# EAGLE schematic auxDaqUnitBottom2022 (EAGLE 9.6.2)

## Sheet 1 of 3
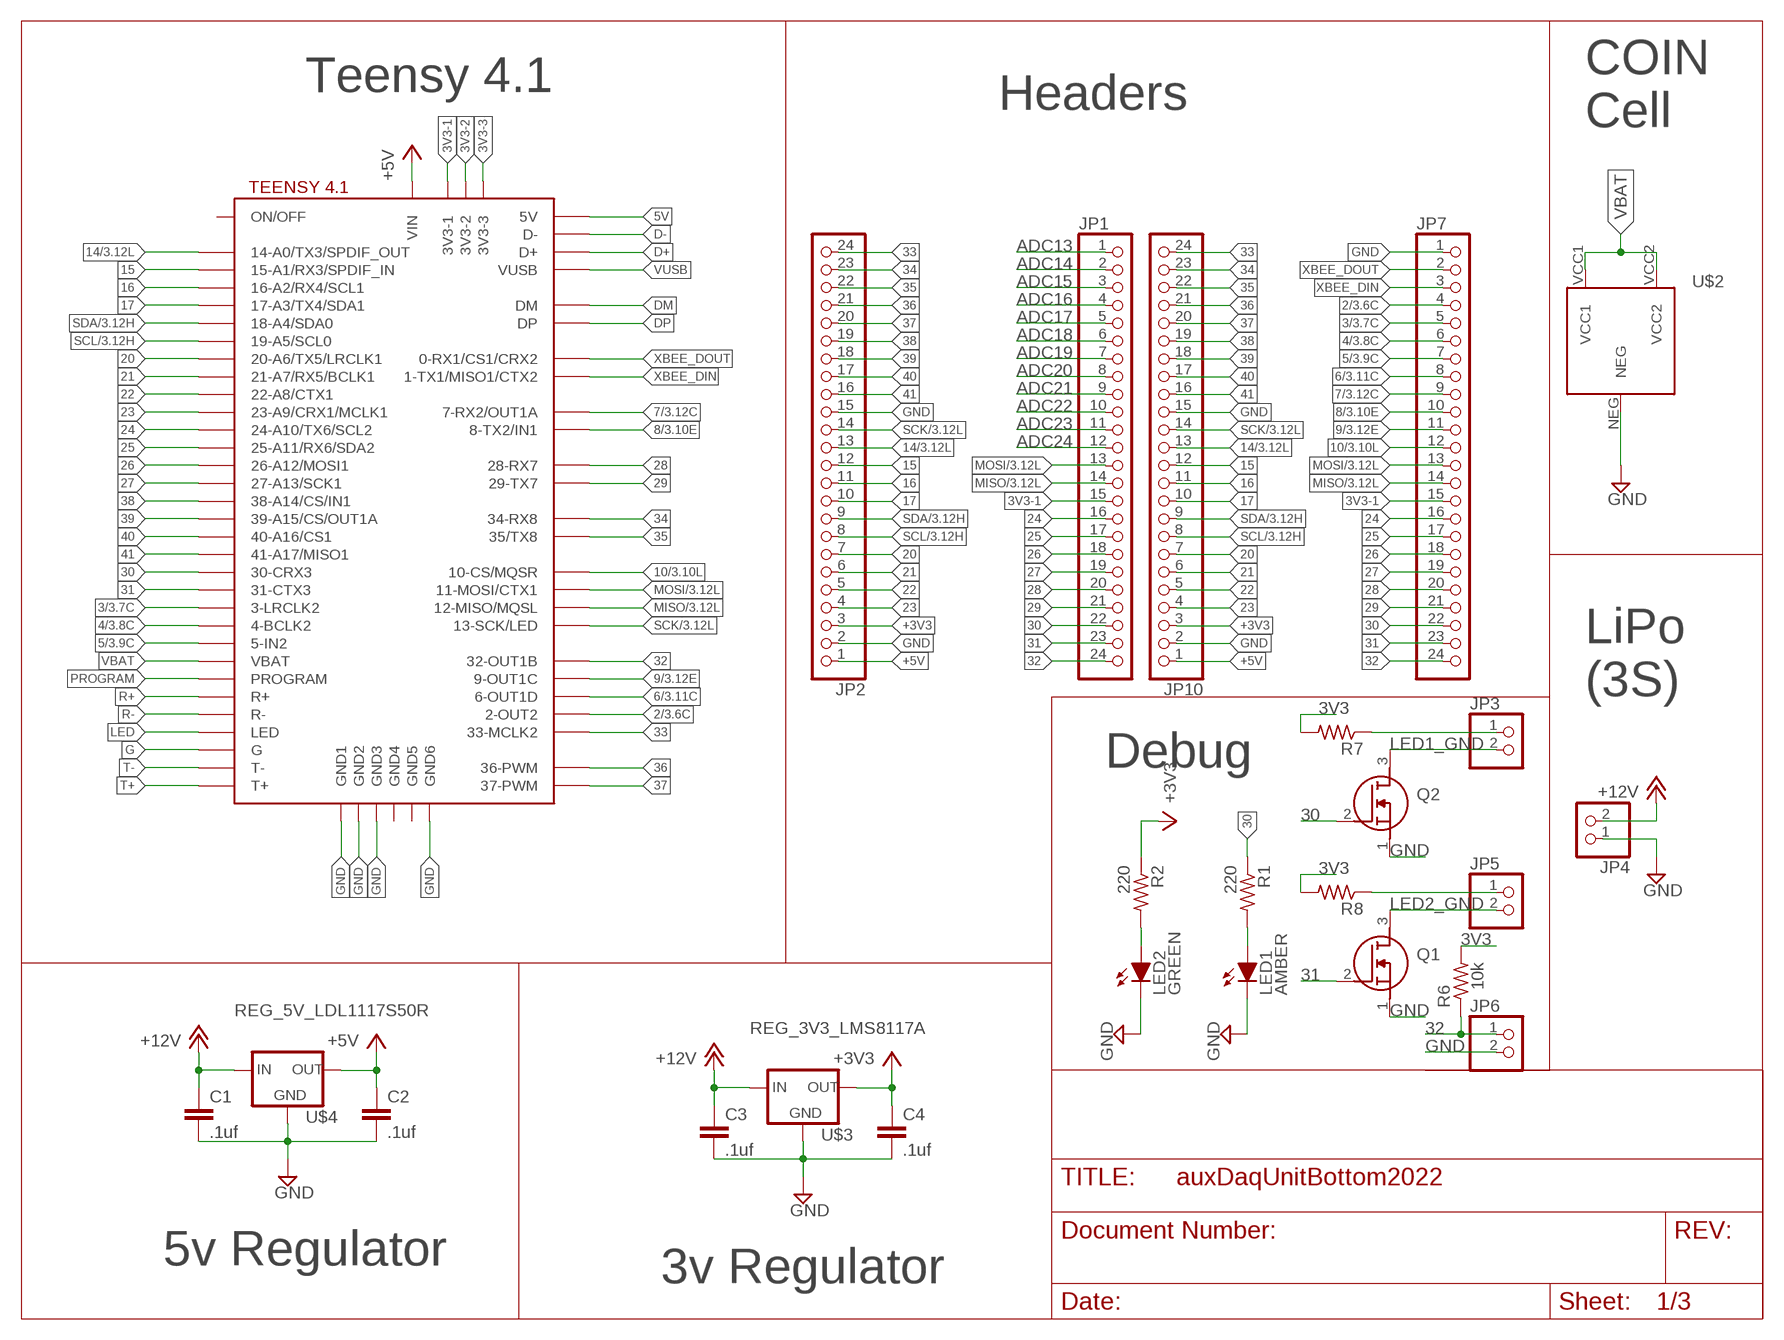
[diagram p0: schematic, sheet 1]
FRAME1 (LETTER_L): NAMEYEAR: PETER2022

### Parts
C1  .1uf  CAP_SMDC0603  [C0603]
C2  .1uf  CAP_SMDC0603  [C0603]
C3  .1uf  CAP_SMDC0603  [C0603]
C4  .1uf  CAP_SMDC0603  [C0603]
JP1  PINHD-1X24  [1X24]
JP2  PINHD-1X24  [1X24]
JP3  PINHD-1X2  [1X02]
JP4  PINHD-1X2  [1X02]
JP5  PINHD-1X2  [1X02]
JP6  PINHD-1X2  [1X02]
JP7  PINHD-1X24  [1X24]
JP10  PINHD-1X24  [1X24]
LED1  AMBER  LED-0603  [LED-603]
LED2  GREEN  LED-0603  [LED-603]
Q1  MOSFET_N-TYPE_RK7002BMT116  [BSS64AHZGT116]
Q2  MOSFET_N-TYPE_RK7002BMT116  [BSS64AHZGT116]
R1  220  RES_SMDR0603  [R0603]
R2  220  RES_SMDR0603  [R0603]
R6  10k  RES_SMDR0603  [R0603]
R7  RES_SMDR0603  [R0603]
R8  RES_SMDR0603  [R0603]
U$1  TEENSY41  [TEENSY41]
U$2  KEYSTONE3035  [KEYSTONE3035]
U$3  REG_3V3_LMS8117A  [SOT223]
U$4  REG_5V_LDL1117S50R  [SOT230P700X180-4N]

### Nets
2: JP7.4 U$1.2-OUT2 ; also sheet 3
3: JP7.5 U$1.3-LRCLK2 ; also sheet 3
3V3: R6.2 R7.2 R8.2
3V3-1: JP1.15 JP7.15 U$1.3V3-1
3V3-2: U$1.3V3-2
3V3-3: U$1.3V3-3
4: JP7.6 U$1.4-BCLK2 ; also sheet 3
5: JP7.7 U$1.5-IN2 ; also sheet 3
5V: U$1.+5V(5V)
6: JP7.8 U$1.6-OUT1D ; also sheet 3
7: JP7.9 U$1.7-RX2/OUT1A ; also sheet 3
8: JP7.10 U$1.8-TX2/IN2(8-TX2/IN1) ; also sheet 3
9: JP7.11 U$1.9-OUT1C ; also sheet 3
10: JP7.12 U$1.10-CS\MQSR(10-CS/MQSR) ; also sheet 3
14: JP2.13 JP10.13 U$1.14-A0/TX3/SPDIF_OUT ; also sheet 3
15: JP2.12 JP10.12 U$1.15-A1/RX3/SPDIF_IN
16: JP2.11 JP10.11 U$1.16-A2/RX4/SCL1
17: JP2.10 JP10.10 U$1.17-A3/TX4/SDA1
20: JP2.7 JP10.7 U$1.20-A6/TX5/LRCLK1
21: JP2.6 JP10.6 U$1.21-A7/RX5/BCLK1
22: JP2.5 JP10.5 U$1.22-A8/CTX1
23: JP2.4 JP10.4 U$1.23-A9/CRX1/MCLK1
24: JP1.16 JP7.16 U$1.24-A10/TX6/SCL2
25: JP1.17 JP7.17 U$1.25-A11/RX6/SDA2
26: JP1.18 JP7.18 U$1.26-A12/MOSI1
27: JP1.19 JP7.19 U$1.27-A13/SCK1
28: JP1.20 JP7.20 U$1.28-RX7
29: JP1.21 JP7.21 U$1.29-TX7
30: JP1.22 JP7.22 Q2.2(G) R1.1 U$1.30-CRX3
31: JP1.23 JP7.23 Q1.2(G) U$1.31-CTX3
32: JP1.24 JP6.1 JP7.24 R6.1 U$1.32-OUT1B
33: JP2.24 JP10.24 U$1.33-MCLK2 ; also sheet 2
34: JP2.23 JP10.23 U$1.34-RX8 ; also sheet 2
35: JP2.22 JP10.22 U$1.35-TX8(35/TX8) ; also sheet 2
36: JP2.21 JP10.21 U$1.36-PWM
37: JP2.20 JP10.20 U$1.37-PWM
38: JP2.19 JP10.19 U$1.38-A14/CS/IN1
39: JP2.18 JP10.18 U$1.39-A15/CS/OUT1A
40: JP2.17 JP10.17 U$1.40-A16/CS1
41: JP2.16 JP10.16 U$1.41-A17/MISO1
+3V3: C4.1 JP2.3 JP10.3 R2.1 U$3.2(OUT) U$3.4(OUT) ; also sheet 2,3
+5V: C2.1 JP2.1 JP10.1 U$1.VIN U$4.2(OUT) U$4.4(OUT) ; also sheet 2,3
+12V: C1.1 C3.1 JP4.2 U$3.3(IN) U$4.3(IN)
ADC13: JP1.1 ; also sheet 2
ADC14: JP1.2 ; also sheet 2
ADC15: JP1.3 ; also sheet 2
ADC16: JP1.4 ; also sheet 2
ADC17: JP1.5 ; also sheet 2
ADC18: JP1.6 ; also sheet 2
ADC19: JP1.7 ; also sheet 2
ADC20: JP1.8 ; also sheet 2
ADC21: JP1.9 ; also sheet 2
ADC22: JP1.10 ; also sheet 2
ADC23: JP1.11 ; also sheet 2
ADC24: JP1.12 ; also sheet 2
D+: U$1.D+
D-: U$1.D-
DM: U$1.DM
DP: U$1.DP
G: U$1.G
GND: C1.2 C2.2 C3.2 C4.2 JP2.2 JP2.15 JP4.1 JP6.2 JP7.1 JP10.2 JP10.15 LED1.C LED2.C Q1.1(S) Q2.1(S) U$1.GND1 U$1.GND2 U$1.GND3 U$1.GND6 U$2.NEG U$3.1(GND) U$4.1(GND) ; also sheet 2,3
LED: U$1.LED
LED1_GND: JP3.2 Q2.3(D)
LED2_GND: JP5.2 Q1.3(D)
MISO: JP1.14 JP7.14 U$1.12-MISO/MQSL ; also sheet 2,3
MOSI: JP1.13 JP7.13 U$1.11-MOSI/CTX1 ; also sheet 2,3
N$1: LED1.A R1.2
N$2: LED2.A R2.2
N$3: JP3.1 R7.1
N$4: JP5.1 R8.1
PROGRAM: U$1.PROGRAM
R+: U$1.R+
R-: U$1.R-
SCK: JP2.14 JP10.14 U$1.13-SCK/LED ; also sheet 2,3
SCL: JP2.8 JP10.8 U$1.19-A5/SCL0 ; also sheet 3
SDA: JP2.9 JP10.9 U$1.18-A4/SDA0 ; also sheet 3
T+: U$1.T+
T-: U$1.T-
VBAT: U$1.VBAT U$2.VCC1 U$2.VCC2
VUSB: U$1.VUSB
XBEE_DIN: JP7.3 U$1.1-TX1/MISO1/CTX2 ; also sheet 2
XBEE_DOUT: JP7.2 U$1.0-RX1/CS1/CRX2 ; also sheet 2
Unconnected: U$1.GND4 U$1.GND5 U$1.ON/OFF

### Notes on the sheet
- Teensy 4.1
- Headers
- COIN
  Cell
- LiPo
  (3S)
- Debug
- 5v Regulator
- 3v Regulator

## Sheet 2 of 3
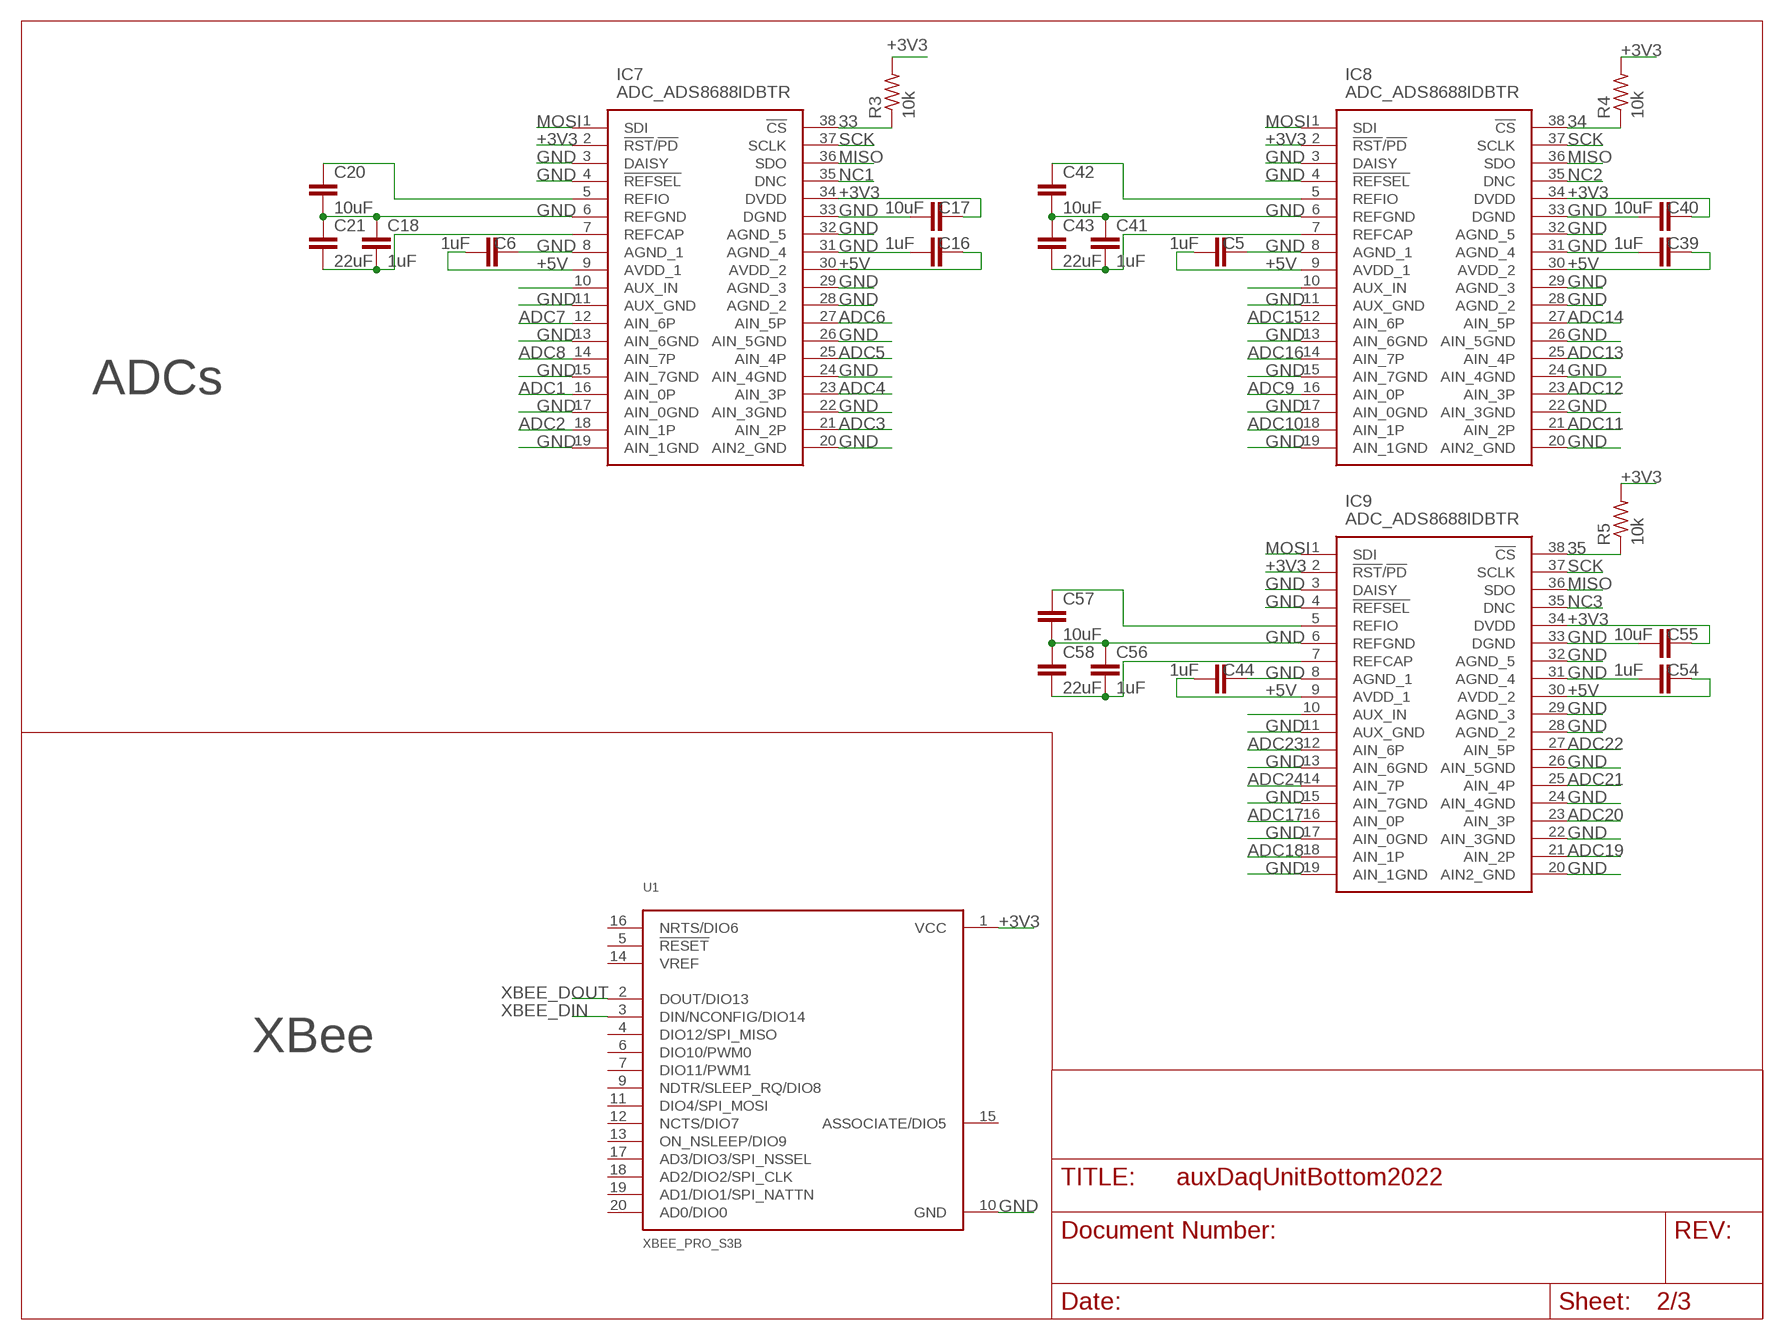
[diagram p1: schematic, sheet 2]

### Parts
C5  1uF  CAP_SMDC0603  [C0603]
C6  1uF  CAP_SMDC0603  [C0603]
C16  1uF  CAP_SMDC0603  [C0603]
C17  10uF  CAP_SMDC0603  [C0603]
C18  1uF  CAP_SMDC0603  [C0603]
C20  10uF  CAP_SMDC0805  [C0805]
C21  22uF  CAP_SMDC1210  [C1210]
C39  1uF  CAP_SMDC0603  [C0603]
C40  10uF  CAP_SMDC0603  [C0603]
C41  1uF  CAP_SMDC0603  [C0603]
C42  10uF  CAP_SMDC0805  [C0805]
C43  22uF  CAP_SMDC1210  [C1210]
C44  1uF  CAP_SMDC0603  [C0603]
C54  1uF  CAP_SMDC0603  [C0603]
C55  10uF  CAP_SMDC0603  [C0603]
C56  1uF  CAP_SMDC0603  [C0603]
C57  10uF  CAP_SMDC0805  [C0805]
C58  22uF  CAP_SMDC1210  [C1210]
IC7  ADC_ADS8688IDBTR  [SOP50P640X120-38N]
IC8  ADC_ADS8688IDBTR  [SOP50P640X120-38N]
IC9  ADC_ADS8688IDBTR  [SOP50P640X120-38N]
R3  10k  RES_SMDR0603  [R0603]
R4  10k  RES_SMDR0603  [R0603]
R5  10k  RES_SMDR0603  [R0603]
U1  XBEE_PRO_S3B  [XBEE_PRO_S3B]

### Nets
33: IC7.38(!CS) R3.1 ; also sheet 1
34: IC8.38(!CS) R4.1 ; also sheet 1
35: IC9.38(!CS) R5.1 ; also sheet 1
+3V3: C17.1 C40.1 C55.1 IC7.2(!RST!/!PD) IC7.34(DVDD) IC8.2(!RST!/!PD) IC8.34(DVDD) IC9.2(!RST!/!PD) IC9.34(DVDD) R3.2 R4.2 R5.2 U1.1(VCC) ; also sheet 1,3
+5V: C5.2 C6.2 C16.1 C39.1 C44.2 C54.1 IC7.9(AVDD_1) IC7.30(AVDD_2) IC8.9(AVDD_1) IC8.30(AVDD_2) IC9.9(AVDD_1) IC9.30(AVDD_2) ; also sheet 1,3
ADC1: IC7.16(AIN_0P) ; also sheet 3
ADC2: IC7.18(AIN_1P) ; also sheet 3
ADC3: IC7.21(AIN_2P) ; also sheet 3
ADC4: IC7.23(AIN_3P) ; also sheet 3
ADC5: IC7.25(AIN_4P) ; also sheet 3
ADC6: IC7.27(AIN_5P) ; also sheet 3
ADC7: IC7.12(AIN_6P) ; also sheet 3
ADC8: IC7.14(AIN_7P) ; also sheet 3
ADC9: IC8.16(AIN_0P) ; also sheet 3
ADC10: IC8.18(AIN_1P) ; also sheet 3
ADC11: IC8.21(AIN_2P) ; also sheet 3
ADC12: IC8.23(AIN_3P) ; also sheet 3
ADC13: IC8.25(AIN_4P) ; also sheet 1
ADC14: IC8.27(AIN_5P) ; also sheet 1
ADC15: IC8.12(AIN_6P) ; also sheet 1
ADC16: IC8.14(AIN_7P) ; also sheet 1
ADC17: IC9.16(AIN_0P) ; also sheet 1
ADC18: IC9.18(AIN_1P) ; also sheet 1
ADC19: IC9.21(AIN_2P) ; also sheet 1
ADC20: IC9.23(AIN_3P) ; also sheet 1
ADC21: IC9.25(AIN_4P) ; also sheet 1
ADC22: IC9.27(AIN_5P) ; also sheet 1
ADC23: IC9.12(AIN_6P) ; also sheet 1
ADC24: IC9.14(AIN_7P) ; also sheet 1
GND: C5.1 C6.1 C16.2 C17.2 C18.1 C20.2 C21.1 C39.2 C40.2 C41.1 C42.2 C43.1 C44.1 C54.2 C55.2 C56.1 C57.2 C58.1 IC7.3(DAISY) IC7.4(!REFSEL) IC7.6(REFGND) IC7.8(AGND_1) IC7.11(AUX_GND) IC7.13(AIN_6GND) IC7.15(AIN_7GND) IC7.17(AIN_0GND) IC7.19(AIN_1GND) IC7.20(AIN2_GND) IC7.22(AIN_3GND) IC7.24(AIN_4GND) IC7.26(AIN_5GND) IC7.28(AGND_2) IC7.29(AGND_3) IC7.31(AGND_4) IC7.32(AGND_5) IC7.33(DGND) IC8.3(DAISY) IC8.4(!REFSEL) IC8.6(REFGND) IC8.8(AGND_1) IC8.11(AUX_GND) IC8.13(AIN_6GND) IC8.15(AIN_7GND) IC8.17(AIN_0GND) IC8.19(AIN_1GND) IC8.20(AIN2_GND) IC8.22(AIN_3GND) IC8.24(AIN_4GND) IC8.26(AIN_5GND) IC8.28(AGND_2) IC8.29(AGND_3) IC8.31(AGND_4) IC8.32(AGND_5) IC8.33(DGND) IC9.3(DAISY) IC9.4(!REFSEL) IC9.6(REFGND) IC9.8(AGND_1) IC9.11(AUX_GND) IC9.13(AIN_6GND) IC9.15(AIN_7GND) IC9.17(AIN_0GND) IC9.19(AIN_1GND) IC9.20(AIN2_GND) IC9.22(AIN_3GND) IC9.24(AIN_4GND) IC9.26(AIN_5GND) IC9.28(AGND_2) IC9.29(AGND_3) IC9.31(AGND_4) IC9.32(AGND_5) IC9.33(DGND) U1.10(GND) ; also sheet 1,3
MISO: IC7.36(SDO) IC8.36(SDO) IC9.36(SDO) ; also sheet 1,3
MOSI: IC7.1(SDI) IC8.1(SDI) IC9.1(SDI) ; also sheet 1,3
N$6: C20.1 IC7.5(REFIO)
N$7: C41.2 C43.2 IC8.7(REFCAP)
N$8: IC8.10(AUX_IN)
N$13: C18.2 C21.2 IC7.7(REFCAP)
N$17: IC7.10(AUX_IN)
N$28: C42.1 IC8.5(REFIO)
N$31: C56.2 C58.2 IC9.7(REFCAP)
N$32: IC9.10(AUX_IN)
N$45: C57.1 IC9.5(REFIO)
NC1: IC7.35(DNC)
NC2: IC8.35(DNC)
NC3: IC9.35(DNC)
SCK: IC7.37(SCLK) IC8.37(SCLK) IC9.37(SCLK) ; also sheet 1,3
XBEE_DIN: U1.3(DIN/NCONFIG/DIO14) ; also sheet 1
XBEE_DOUT: U1.2(DOUT/DIO13) ; also sheet 1
Unconnected: U1.4(DIO12/SPI_MISO) U1.5(!RESET) U1.6(DIO10/PWM0) U1.7(DIO11/PWM1) U1.9(NDTR/SLEEP_RQ/DIO8) U1.11(DIO4/SPI_MOSI) U1.12(NCTS/DIO7) U1.13(ON_NSLEEP/DIO9) U1.14(VREF) U1.15(ASSOCIATE/DIO5) U1.16(NRTS/DIO6) U1.17(AD3/DIO3/SPI_NSSEL) U1.18(AD2/DIO2/SPI_CLK) U1.19(AD1/DIO1/SPI_NATTN) U1.20(AD0/DIO0)

### Notes on the sheet
- ADCs
- XBee

## Sheet 3 of 3
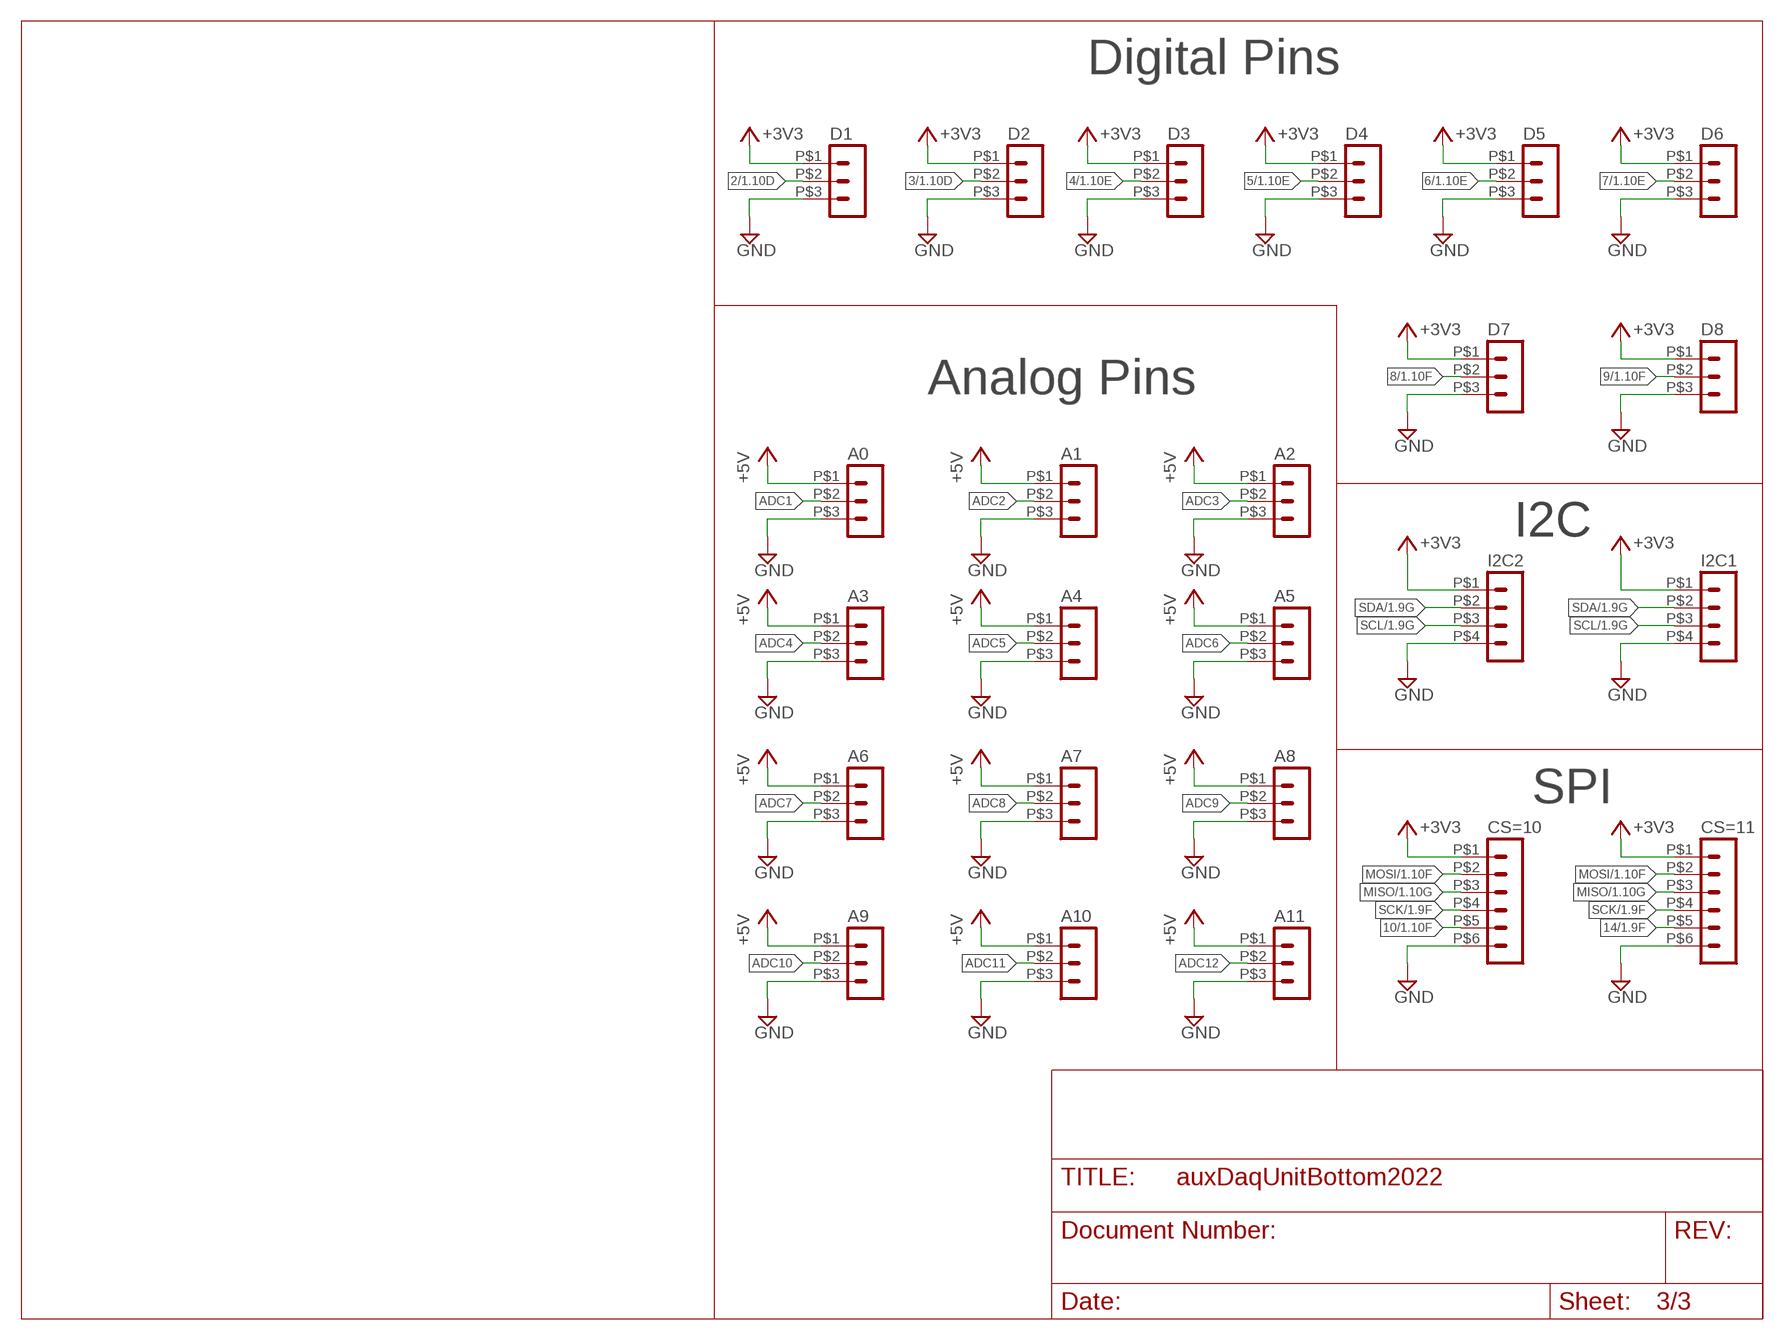
[diagram p2: schematic, sheet 3]

### Parts
A0  HEADER_POS3_43650-0300  [43650-0300]
A1  HEADER_POS3_43650-0300  [43650-0300]
A2  HEADER_POS3_43650-0300  [43650-0300]
A3  HEADER_POS3_43650-0300  [43650-0300]
A4  HEADER_POS3_43650-0300  [43650-0300]
A5  HEADER_POS3_43650-0300  [43650-0300]
A6  HEADER_POS3_43650-0300  [43650-0300]
A7  HEADER_POS3_43650-0300  [43650-0300]
A8  HEADER_POS3_43650-0300  [43650-0300]
A9  HEADER_POS3_43650-0300  [43650-0300]
A10  HEADER_POS3_43650-0300  [43650-0300]
A11  HEADER_POS3_43650-0300  [43650-0300]
CS=10  HEADER_POS6_43045-0600  [43045-0600]
CS=11  HEADER_POS6_43045-0600  [43045-0600]
D1  HEADER_POS3_43650-0300  [43650-0300]
D2  HEADER_POS3_43650-0300  [43650-0300]
D3  HEADER_POS3_43650-0300  [43650-0300]
D4  HEADER_POS3_43650-0300  [43650-0300]
D5  HEADER_POS3_43650-0300  [43650-0300]
D6  HEADER_POS3_43650-0300  [43650-0300]
D7  HEADER_POS3_43650-0300  [43650-0300]
D8  HEADER_POS3_43650-0300  [43650-0300]
I2C1  HEADER_POS4_43045-0401  [43045-0400]
I2C2  HEADER_POS4_43045-0401  [43045-0400]

### Nets
2: D1.P$2 ; also sheet 1
3: D2.P$2 ; also sheet 1
4: D3.P$2 ; also sheet 1
5: D4.P$2 ; also sheet 1
6: D5.P$2 ; also sheet 1
7: D6.P$2 ; also sheet 1
8: D7.P$2 ; also sheet 1
9: D8.P$2 ; also sheet 1
10: CS=10.P$5 ; also sheet 1
14: CS=11.P$5 ; also sheet 1
+3V3: CS=10.P$1 CS=11.P$1 D1.P$1 D2.P$1 D3.P$1 D4.P$1 D5.P$1 D6.P$1 D7.P$1 D8.P$1 I2C1.P$1 I2C2.P$1 ; also sheet 1,2
+5V: A0.P$1 A1.P$1 A2.P$1 A3.P$1 A4.P$1 A5.P$1 A6.P$1 A7.P$1 A8.P$1 A9.P$1 A10.P$1 A11.P$1 ; also sheet 1,2
ADC1: A0.P$2 ; also sheet 2
ADC2: A1.P$2 ; also sheet 2
ADC3: A2.P$2 ; also sheet 2
ADC4: A3.P$2 ; also sheet 2
ADC5: A4.P$2 ; also sheet 2
ADC6: A5.P$2 ; also sheet 2
ADC7: A6.P$2 ; also sheet 2
ADC8: A7.P$2 ; also sheet 2
ADC9: A8.P$2 ; also sheet 2
ADC10: A9.P$2 ; also sheet 2
ADC11: A10.P$2 ; also sheet 2
ADC12: A11.P$2 ; also sheet 2
GND: A0.P$3 A1.P$3 A2.P$3 A3.P$3 A4.P$3 A5.P$3 A6.P$3 A7.P$3 A8.P$3 A9.P$3 A10.P$3 A11.P$3 CS=10.P$6 CS=11.P$6 D1.P$3 D2.P$3 D3.P$3 D4.P$3 D5.P$3 D6.P$3 D7.P$3 D8.P$3 I2C1.P$4 I2C2.P$4 ; also sheet 1,2
MISO: CS=10.P$3 CS=11.P$3 ; also sheet 1,2
MOSI: CS=10.P$2 CS=11.P$2 ; also sheet 1,2
SCK: CS=10.P$4 CS=11.P$4 ; also sheet 1,2
SCL: I2C1.P$3 I2C2.P$3 ; also sheet 1
SDA: I2C1.P$2 I2C2.P$2 ; also sheet 1

### Notes on the sheet
- Digital Pins
- Analog Pins
- I2C
- SPI

## Library data of the parts
A0 A1-A11 D1-D8 = GTOR - Microfit Connector:HEADER_POS3_?: Molex - Micro-Fit 3.0 Series connector, 3.00mm (0.118") pitch header, 3 positions.
C1-C6 C16-C18 C20 C21 C39-C44 C54-C58 = GTOR - Passive Components:CAP_SMD: CAPACITOR, European symbol; SPICEPREFIX: C
CS=10 CS=11 = GTOR - Microfit Connector:HEADER_POS6_?: Molex - Micro-Fit 3.0 Series connector, 3.00mm (0.118") pitch header, 6 positions.
I2C1 I2C2 = GTOR - Microfit Connector:HEADER_POS4_?: Molex - Micro-Fit 3.0 Series connector, 3.00mm (0.118") pitch header, 4 positions.
IC7-IC9 = GTOR - Active Components:ADC_ADS8688IDBTR: Octal Channel Single ADC SAR 500ksps 16-bit Serial 38-Pin TSSOP T/R Source: Datasheet <https://www.arrow.com/en/products/ads8688idbtr/texas-instruments>; ARROW_PART_NUMBER: ADS8688IDBTR; ARROW_PRICE-STOCK: https://www.arrow.com/en/products/ads8688idbtr/texas-instruments?region=nac; DESCRIPTION: Octal Channel Single ADC SAR 500ksps 16-bit Serial 38-Pin TSSOP T/R; HEIGHT: 1.2mm; MANUFACTURER_NAME: Texas Instruments; MANUFACTURER_PART_NUMBER: ADS8688IDBTR; MOUSER_PART_NUMBER: 595-ADS8688IDBTR; MOUSER_PRICE-STOCK: https://www.mouser.co.uk/ProductDetail/Texas-Instruments/ADS8688IDBTR?qs=bZA2O%252B%252B1GJuPFEagMJIgMw%3D%3D
JP1 JP2 JP7 JP10 = GTOR - Connectors:PINHD-1X24: PIN HEADER
JP3-JP6 = GTOR - Connectors:PINHD-1X2: PIN HEADER
LED1 LED2 = GTOR - Passive Components:LED: Light Emitting Diode (LED) Source: Dangerous Prototypes Eagle Library <https://github.com/DangerousPrototypes/Eagle_Part_Library>
Q1 Q2 = GTOR - Active Components:MOSFET_N-TYPE_RK7002BMT116: 2.5V Drive Nch MOSFET: MOSFETs are made as ultra-low ON-resistance by the micro-processing technologies suitable for mobilr equipment for low current consumption. In wide lineup including compact type, high-power type and complex type to meet in the market. Source: Datasheet <https://datasheet.datasheetarchive.com/originals/distributors/DKDS-18/356920.pdf>; DESCRIPTION: 2.5V Drive Nch MOSFET: MOSFETs are made as ultra-low ON-resistance by the micro-processing technologies suitable for mobilr equipment for low current consumption. In wide lineup including compact type, high-power type and complex type to meet in the market.; HEIGHT: 1.2mm; MANUFACTURER_NAME: ROHM Semiconductor; MANUFACTURER_PART_NUMBER: RK7002BMT116; MOUSER_PART_NUMBER: 755-RK7002BMT116; MOUSER_PRICE-STOCK: https://www.mouser.co.uk/ProductDetail/ROHM-Semiconductor/RK7002BMT116?qs=npTsUczJOtO4aXz%2Fx%2FNVUw%3D%3D
R1-R8 = GTOR - Passive Components:RES_SMD: RESISTOR, American symbol; SPICEPREFIX: R
U1 = GTOR - Microcontroller:XBEE_PRO_S3B: XBee-PRO 900HP DigiMesh 900 MHz 200 Kbps RF Module with U.FL Connector; DESCRIPTION: General ISM < 1GHz Transceiver Module 900MHz Antenna Not Included, RP-SMA Through Hole; DIGI-KEY_PART_NUMBER: 602-1293-ND; MF: Digi International; MP: XBP9B-XCST-001; PACKAGE: Module Digi International
U$1 = GTOR - Microcontroller:TEENSY41
U$2 = GTOR - Passive Components:KEYSTONE3035: RTC clock battery holder Works with 2016, 2020, 2025, 2032 coin cell batterys. Keystone 3035 Digikey Link <https://www.digikey.com/en/products/detail/keystone-electronics/3035/5872907>
U$3 = GTOR - Active Components:REG_3V3_LMS8117A: Texas Instruments LM3940 3.3V Linear Regulator Datasheet <http://www.ti.com/lit/ds/symlink/lm3940.pdf> Use with 0.47µF input capacitor and 33µF output capacitor.
U$4 = GTOR - Active Components:REG_5V_LDL1117S50R